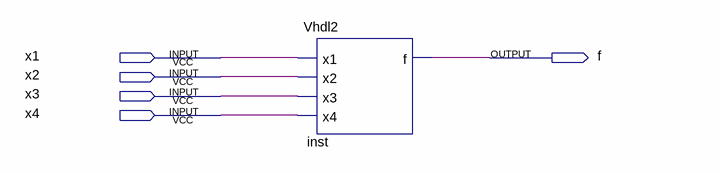
[diagram p0: schematic sheet]
// Quartus schematic vhdl2ckt.bdf as structural Verilog: 1 symbols, 5 pins
module vhdl2ckt (
  input  x1,
  input  x2,
  input  x3,
  input  x4,
  output f
);

  Vhdl2 inst (.x1(x1), .x2(x2), .x3(x3), .x4(x4), .f(f));
endmodule
